# Altium schematic sheet Puente H.SchDoc
size A4; DocumentNumber: 3; SheetNumber: 3; SheetTotal: 7
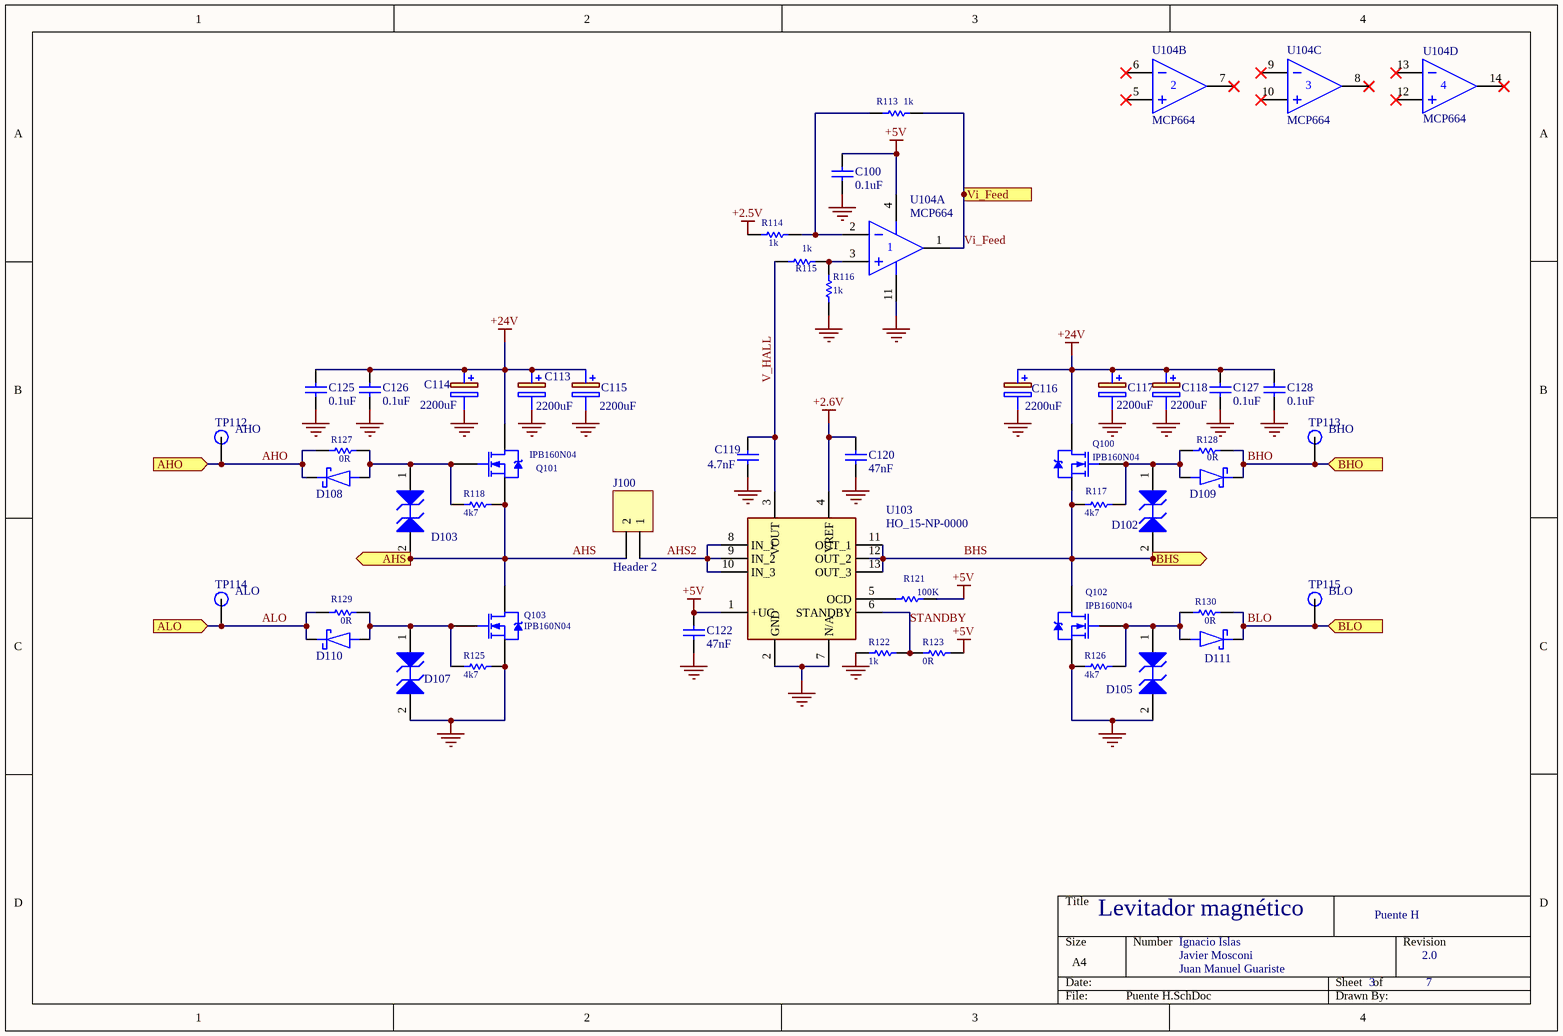
[diagram p0: Puente H.SchDoc]

## Parts
C100  value 0.1uF  [C1206]  (hidden comment: Capacitor)
C113  value 2200uF  [CAPPRD500W60D1300H2650]  (hidden comment: EKY-350ELL102MK25S)
C114  value 2200uF  [CAPPRD500W60D1300H2650]  (hidden comment: EKY-350ELL102MK25S)
C115  value 2200uF  [CAPPRD500W60D1300H2650]  (hidden comment: EKY-350ELL102MK25S)
C116  value 2200uF  [CAPPRD500W60D1300H2650]  (hidden comment: EKY-350ELL102MK25S)
C117  value 2200uF  [CAPPRD500W60D1300H2650]  (hidden comment: EKY-350ELL102MK25S)
C118  value 2200uF  [CAPPRD500W60D1300H2650]  (hidden comment: EKY-350ELL102MK25S)
C119  value 4.7nF  [C1206]  (hidden comment: Capacitor)
C120  value 47nF  [C1206]  (hidden comment: Capacitor)
C122  value 47nF  [C1206]  (hidden comment: Capacitor)
C125  value 0.1uF  [C1206]  (hidden comment: Capacitor)
C126  value 0.1uF  [C1206]  (hidden comment: Capacitor)
C127  value 0.1uF  [C1206]  (hidden comment: Capacitor)
C128  value 0.1uF  [C1206]  (hidden comment: Capacitor)
D102  SMAJ15A  [ONSC-SMA-2-403D-02_F_V]  (value not drawn)
D103  SMAJ15A  [ONSC-SMA-2-403D-02_F_V]  (value not drawn)
D105  SMAJ15A  [ONSC-SMA-2-403D-02_F_V]  (value not drawn)
D107  SMAJ15A  [ONSC-SMA-2-403D-02_F_V]  (value not drawn)
D108  RSX205LAM30TR  [SODFL4725X105N]  (value not drawn)
D109  RSX205LAM30TR  [SODFL4725X105N]  (value not drawn)
D110  RSX205LAM30TR  [SODFL4725X105N]  (value not drawn)
D111  RSX205LAM30TR  [SODFL4725X105N]  (value not drawn)
J100  Header 2  [SMKDS5-2-9.5]
Q100  IPB160N04  [TO263-7S]
Q101  IPB160N04  [TO263-7S]
Q102  IPB160N04  [TO263-7S]
Q103  IPB160N04  [TO263-7S]
R113  1k  [R1206]
R114  1k  [R1206]
R115  1k  [R1206]
R116  1k  [R1206]
R117  4k7  [R1206]
R118  4k7  [R1206]
R121  100K  [R1206]
R122  1k  [R1206]
R123  0R  [R1206]
R125  4k7  [R1206]
R126  4k7  [R1206]
R127  0R  [R1206]
R128  0R  [R1206]
R129  0R  [R1206]
R130  0R  [R1206]
TP112  AHO  [TestPoint Keystone 5000 Silver-Red]
TP113  BHO  [TestPoint Keystone 5000 Silver-Red]
TP114  ALO  [TestPoint Keystone 5000 Silver-Red]
TP115  BLO  [TestPoint Keystone 5000 Silver-Red]
U103  HO_15-NP-0000  [HO15NP0000]
U104  MCP664  [SOIC14]  (parts A,B,C,D of 4)

## Ports
AHO (in), AHS (out), ALO (in), BHO (in), BHS (out), BLO (in), Vi_Feed (out)

## Nets
+2.5V: R114.1
+2.6V: C120.1 U103.4(VREF)
+5V: C100.1 C122.2 R121.2 R123.1 U103.1(+UC) U104.4(V+)
+24V: C113.1(+) C114.1(+) C115.1(+) C116.1(+) C117.1(+) C118.1(+) C125.2 C126.2 C127.2 C128.2 Q100.4(D) Q101.4(D)
GND: C100.2 C113.2(-) C114.2(-) C115.2(-) C116.2(-) C117.2(-) C118.2(-) C119.1 C120.2 C122.1 C125.1 C126.1 C127.1 C128.1 D105.2(A2) D107.2(A2) Q102.2(S) Q102.3(S) Q102.5(S) Q102.6(S) Q102.7(S) Q103.2(S) Q103.3(S) Q103.5(S) Q103.6(S) Q103.7(S) R116.1 R122.2 R125.2 R126.1 U103.2(GND) U103.7(N/A) U104.11(V-)
AHO: D108.1(K) R127.1 TP112.1 ; port AHO
AHS: D103.2(A2) J100.2 Q101.2(S) Q101.3(S) Q101.5(S) Q101.6(S) Q101.7(S) Q103.4(D) R118.2 ; port AHS
AHS2: J100.1 U103.8(IN_1) U103.9(IN_2) U103.10(IN_3)
ALO: D110.1(K) R129.1 TP114.1 ; port ALO
BHO: D109.1(K) R128.2 TP113.1 ; port BHO
BHS: D102.2(A2) Q100.2(S) Q100.3(S) Q100.5(S) Q100.6(S) Q100.7(S) Q102.4(D) R117.1 U103.11(OUT_1) U103.12(OUT_2) U103.13(OUT_3) ; port BHS
BLO: D111.1(K) R130.2 TP115.1 ; port BLO
STANDBY: R122.1 R123.2 U103.6(STANDBY)
V_HALL: C119.2 R115.1 U103.3(VOUT)
Vi_Feed: R113.2 U104.1(OUT) ; port Vi_Feed
NetD102_1: D102.1(A1) D109.2(A) Q100.1(G) R117.2 R128.1
NetD103_1: D103.1(A1) D108.2(A) Q101.1(G) R118.1 R127.2
NetD105_1: D105.1(A1) D111.2(A) Q102.1(G) R126.2 R130.1
NetD107_1: D107.1(A1) D110.2(A) Q103.1(G) R125.1 R129.2
NetR113_1: R113.1 R114.2 U104.2(IN-)
NetR115_2: R115.2 R116.2 U104.3(IN+)
NetR121_1: R121.1 U103.5(OCD)

Not connected (* = marked no-connect by the designer): U104 5(IN+)* 6(IN-)* 7(OUT)* 8(OUT)* 9(IN-)* 10(IN+)* 12(IN+)* 13(IN-)* 14(OUT)*

## Notes on the sheet
- Levitador magnético
- Puente H
- Ignacio Islas
- Javier Mosconi
- Juan Manuel Guariste
- 2.0

## Library data of the parts
C100 C125-C128 = Capacitor: CAP CER 0.1UF 50V X7R 1206; Manufacturer: Venkel; Mfr PN: C1206X7R500-104KNE; Supplier 1: Digi-Key; Supplier 1 PN: 2679-C1206X7R500-104KNETR-ND
C113-C118 = EKY-350ELL102MK25S: CAP ALUM 2200UF 20% 35V RADIAL; Manufacturer: United Chemi-Con; Mfr PN: EKY-350ELL222MM25S; Datasheet Link: https://www.digikey.com/en/products/detail/united-chemi-con/EKY-350ELL222MM25S/756106; Supplier 1 PN: 565-1590-ND; Supplier 1: Digi-Key
C119 = Capacitor: CAP CER 4700PF 200V X7R 1206; Manufacturer: CAL-CHIP ELECTRONICS, INC.; Mfr PN: GMC31X7R472K200NT; Ssupplier 1: Digi-Key; Supplier 1 PN: 2571-GMC31X7R472K200NTTR-ND
C120 C122 = Capacitor: CAP CER 0.047UF 50V C0G/NP0 1206; Manufacturer: CAL-CHIP ELECTRONICS, INC.; Mfr PN: GMC31CG473J50NT; Supplier 1: Digi-Key; Supplier 1 PN: 2571-GMC31CG473J50NTTR-ND
D102 D103 D105 D107 = 1SMA60CAT3G: TVS DIODE 18VWM 29.2VC DO214AC; Mfr PN: SMAJ18A; Manufacturer: Littelfuse Inc.; Supplier 1: Digi-Key; Supplier 1 PN: SMAJ18ALFCT-ND; ComponentLink1Description: Manufacturer URL; ComponentLink1URL: http://www.onsemi.com/; ComponentLink2Description: Datasheet; ComponentLink2URL: http://www.onsemi.com/pub_link/Collateral/1SMA10CAT3-D.PDF; ComponentLink3Description: Package Specification; ComponentLink3URL: http://www.onsemi.com/pub_link/Collateral/1SMA5913BT3-D.PDF
D108-D111 = RSX205LAM30TR: DIODE SCHOTTKY 30V 2A PMDTM; Manufacturer: ROHM Semiconductor; Datasheet Link: https://fscdn.rohm.com/en/products/databook/datasheet/discrete/diode/schottky_barrier/rsx205lam30tr-e.pdf; Supplier 1 PN: 1.05mm; Mfr PN: RSX205LAM30TR; Supplier 1: RSX205LAM30CT-ND
J100 = Header 2: TERM BLK 2P SIDE ENT 2.54MM PCB; Mfr PN: 282834-2; Manufacturer: TE Connectivity AMP Connectors; Supplier 1: Digi-Key; Link: https://www.digikey.com/en/products/detail/te-connectivity-amp-connectors/282834-2/1150135; Supplier 1 PN: A98333-ND
Q100-Q103 = IPB160N04: MOSFET N-CH 40V 160A TO263-7; Mfr PN: IPB160N04S3H2ATMA1; Manufacturer: Infineon Technologies; Datasheet: https://www.infineon.com/dgdl/Infineon-IPB160N04S3_H2-DS-v01_00-en.pdf?fileId=db3a304412b407950112b42b8da04548&ack=t; Supplier 1: Digi-Key; Supplier 1 PN: IPB160N04S3H2ATMA1CT-ND
R113-R116 R122 = R1206: RES 1K OHM 1% 1/4W 1206; Manufacturer: Stackpole Electronics Inc; Mfr PN: RMCF1206FT1K00; PackageReference: 1206; Supplier 1: Digi-Key; Value: 1k; Tolerance: 1%; Supplier 1 PN: RMCF1206FT1K00CT-ND
R117 R118 R125 R126 = R1206: RES 4.7K OHM 1% 1/4W 1206; Mfr PN: RMCF1206FT4K70; Manufacturer: Stackpole Electronics Inc; Supplier 1 PN: RMCF1206FT4K70CT-ND; PackageReference: 1206; Supplier 1: Digi-Key; Value: 4k7; Tolerance: 1%
R121 = R1206: RES 100K OHM 1% 1/4W 1206; Mfr PN: RMCF1206FT100K; Manufacturer: Stackpole Electronics Inc; PackageReference: 1206; Supplier 1: Digi-Key; Value: 100K; Tolerance: 1%; Supplier 1 PN: RMCF1206FT100KCT-ND
R123 R127-R130 = R1206: RES 0 OHM JUMPER 1/4W 1206; Manufacturer: Stackpole Electronics Inc; Mfr PN: RMCF1206ZT0R00; PackageReference: 1206; Supplier 1: Digi-Key; Value: 0R; Supplier 1 PN: RMCF1206ZT0R00CT-ND
TP112-TP115 = Testpoint: PC TEST POINT MINIATURE RED; Manufacturer: Keystone Electronics; Mfr PN: 5000; Link: https://www.digikey.com/en/products/detail/keystone-electronics/5000/255326; Supplier 1 PN: 36-5000-ND; Supplier 1: Digi-Key
U103 = HO_15-NP-0000: SENSOR CURRENT HALL 15A AC/DC; Mfr PN: HO 15-NP-0000; Manufacturer: LEM USA Inc.; Datasheet Link: http://www.farnell.com/datasheets/2150001.pdf; Supplier 1 PN: 398-1142-ND; Supplier 1: Digi-Key
U104 = MCP664: IC OPAMP GP 4 CIRCUIT 14TSSOP; Part Number: MCP664-E/ST; Manufacturer: Microchip Technology; Datasheet: https://ar.mouser.com/datasheet/2/268/20002194E-2448650.pdf; Supplier 1: Digi-Key; Supplier 1 PN: MCP664-E/ST-ND